# Altium schematic sheet Power.SchDoc: Power
size Tabloid; ApprovedBy: NA; CompanyName: Cospan Design LLC; DrawnBy: David McCoy; Engineer: David McCoy; DocumentNumber: 15; Revision: A; SheetNumber: 15; SheetTotal: 18; Client: OSH; Project: Guppy Buddy; ProjectPrettyName: Guppy Buddy
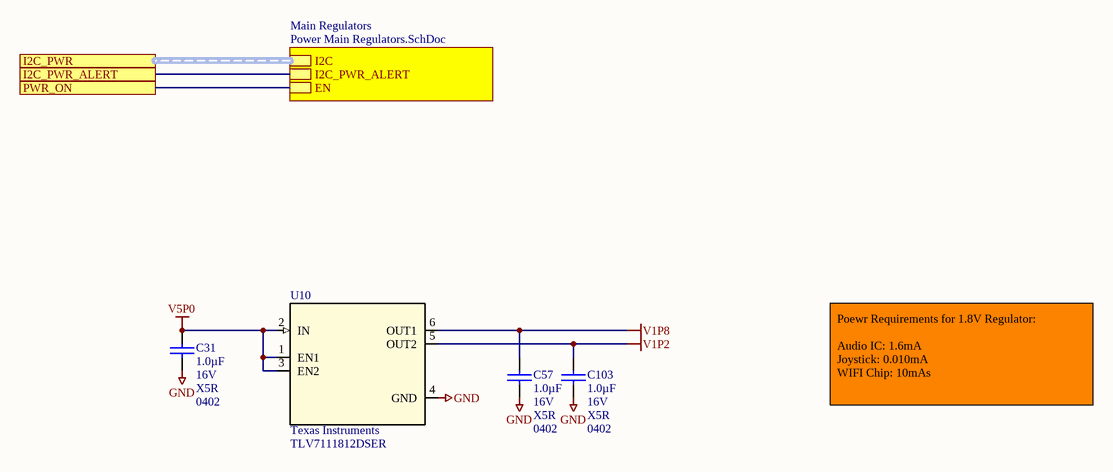
[diagram p0: Power.SchDoc]

## Parts
C31  Capacitance: 1.0µF  Voltage - Rated: 16V  Temperature Coefficient: X5R  Package / Case: 0402  [C_0402]  (hidden comment: 1.0uF)
C57  Capacitance: 1.0µF  Voltage - Rated: 16V  Temperature Coefficient: X5R  Package / Case: 0402  [C_0402]  (hidden comment: 1.0uF)
C103  Capacitance: 1.0µF  Voltage - Rated: 16V  Temperature Coefficient: X5R  Package / Case: 0402  [C_0402]  (hidden comment: 1.0uF)
U10  Manufacturer 1: Texas Instruments  Manufacturer Part Number 1: TLV7111812DSER  [DSE6]  (hidden comment: U_TLV7111812DSER)

## Sub-sheets
Main Regulators = Power Main Regulators.SchDoc: I2C (harness I2C Harness), I2C_PWR_ALERT, EN

## Ports
I2C_PWR (harness I2C Harness), I2C_PWR_ALERT, PWR_ON

## Nets
GND: C31.1 C57.1 C103.1 U10.4(GND)
V1P2: C103.2 U10.5(OUT2)
V1P8: C57.2 U10.6(OUT1)
V5P0: C31.2 U10.1(EN1) U10.2(IN) U10.3(EN2)
I2C_PWR_ALERT: port I2C_PWR_ALERT, sheet Main Regulators/I2C_PWR_ALERT
PWR_ON: port PWR_ON, sheet Main Regulators/EN

## Buses and harness runs
harness port I2C_PWR = sheet Main Regulators/I2C

## Notes on the sheet
- Poewr Requirements for 1.8V Regulator:
  Audio IC: 1.6mA
  Joystick: 0.010mA
  WIFI Chip: 10mAs
- Project:
- http://www.cospandesign.com
- Cospan Design
- Document:
- Engineer:
- Title:
- Client:
- Approved By:
- Revision:
- Date:
- Number:
- of

## Library data of the parts
C31 C57 C103 = C_0402_1.0UF_16V: CAP CER 1.0UF 16V X5R 0402; Manufacturer 1: Samsung; Manufacturer Part Number 1: CL05A105KO5NNNC; Tolerance: 10%; Description 1: Cap Ceramic 1uF 16V X5R 10% SMD 0402 85C Paper T/R; Supplier 1: Digi-Key; Stock 1: 26908; Pricing 1: 1=0.1, 10=0.062, 100=0.0276, 500=0.01968, 1000=0.01547, 2500=0.01406, 5000=0.01294 (USD); Packaging: Tape and Reel; ComponentLink1URL: http://ds.yuden.co.jp/TYCOMPAS/ut/detail.do?productNo=EMK105BJ105KV-F&fileName=EMK105BJ105KV-F_SS&mode=specSheetDownload; ComponentLink1Description: http://ds.yuden.co.jp/TYCOMPAS/ut/detail.do?productNo=EMK105BJ105KV-F&fileName=EMK105BJ105KV-F_SS&mode=specSheetDownload; Supplier Part Number 1: 1276-1067-6-ND; ComponentLink2URL: https://datasheet.ciiva.com/16207/cl05a105ko5nnnc-16207571.pdf; ComponentLink2Description: https://datasheet.ciiva.com/16207/cl05a105ko5nnnc-16207571.pdf; ComponentLink3URL: https://datasheet.ciiva.com/15195/getdatasheetpartid-355272-15195629.pdf; ComponentLink3Description: https://datasheet.ciiva.com/15195/getdatasheetpartid-355272-15195629.pdf; Mount: Surface Mount; Case/Package: 0402; Case Code (Metric): 1005; Case Code (Imperial): 0402; Contact Plating: Tin; Min Operating Temperature: -55°C; Max Operating Temperature: 85°C; Dielectric: X5R; Package Quantity: 1; Voltage Rating: 16V; Voltage: 16V; Length: 1mm; Height: 0.5mm; Width: 0.02inch; Thickness: 0.022inch; Depth: 0.5mm; Radiation Hardening: No
U10 = U_TLV7111812DSER: IC REG LDO 1.8V/1.2V 0.2A 6WSON; Built_By: EMA_UL_Team; Output Current: 200mA; Output Voltage: 1.2V; Max Input Voltage: 5.5V; Min Input Voltage: 2V; Number of Regulators: 2; Min Current Limit: 220mA; Power Supply Rejection Ratio (PSRR): 50dB; Quiescent Current: 30uA; Dropout Voltage: 175mV; Output Type: Fixed; Manufacturer_Part_Number: TLV7111812DSER; Vendor: Texas Instruments; RefDes: RefDes; Type: DEV; Value: Value; Description 1: IC REG LDO 1.8V/1.2V 0.2A 6WSON; Stock 1: 3457; Number of Pins: 6; Min Operating Temperature: -40°C; Max Operating Temperature: 125°C; Packaging: Tape and Reel; Package Quantity: 3000; Number of Outputs: 2; Lead Free: Lead Free; ComponentLink1URL: http://www.ti.com/lit/ds/symlink/tlv711.pdf; ComponentLink1Description: http://www.ti.com/lit/ds/symlink/tlv711.pdf; Supplier 1: Digi-Key; Supplier Part Number 1: 296-35050-6-ND; Pricing 1: 1=0.58, 10=0.51, 100=0.3909, 500=0.309, 1000=0.2472 (USD)